# EAGLE schematic schematic (EAGLE 8.6.0)
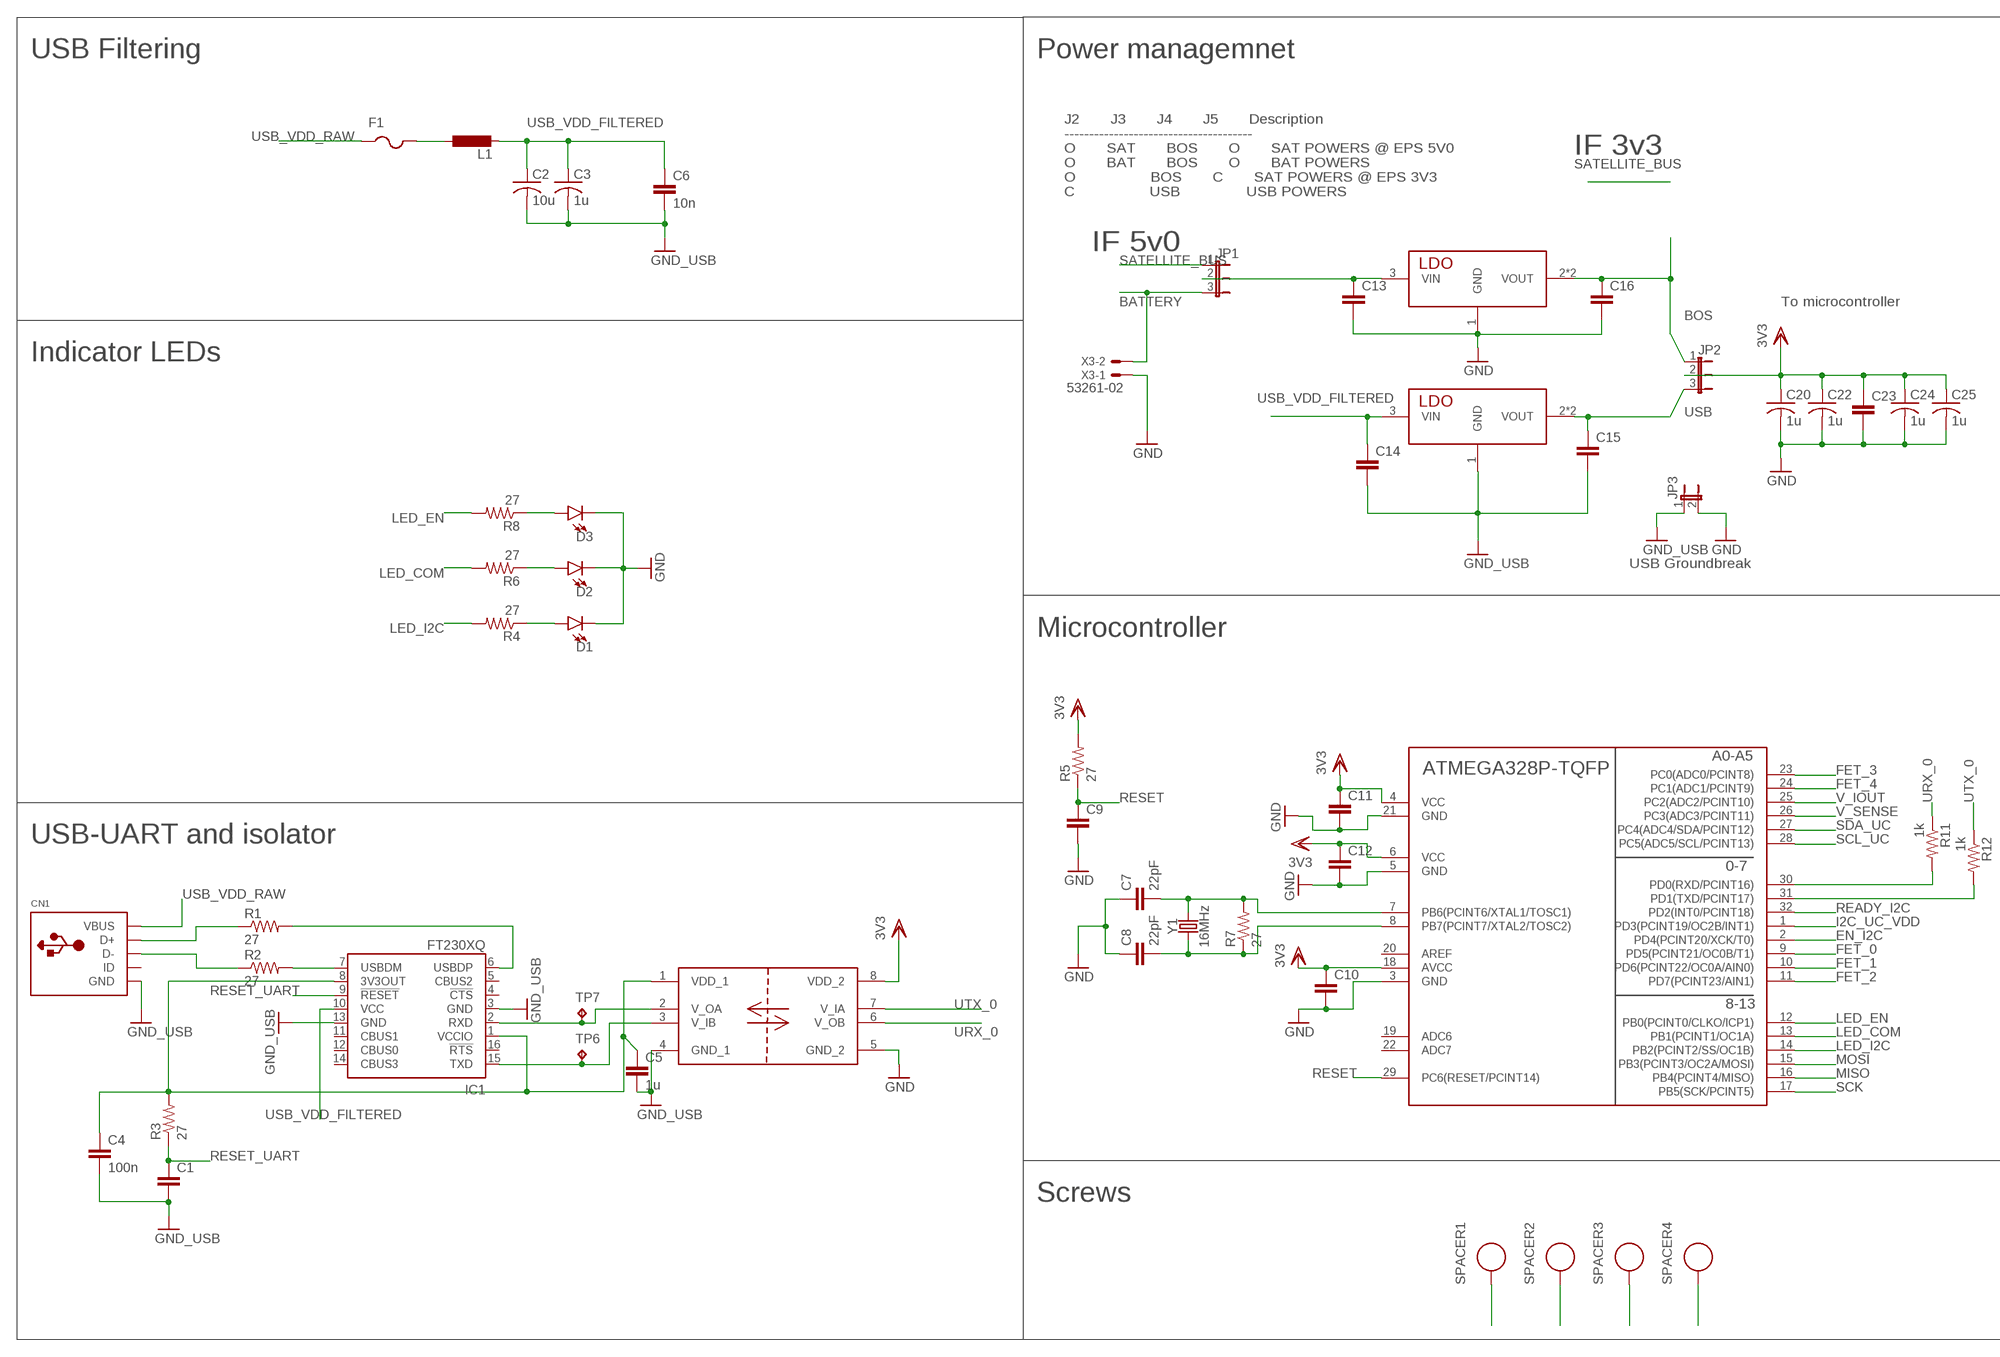
[diagram p0: schematic, sheet 1, part 1 of 2]
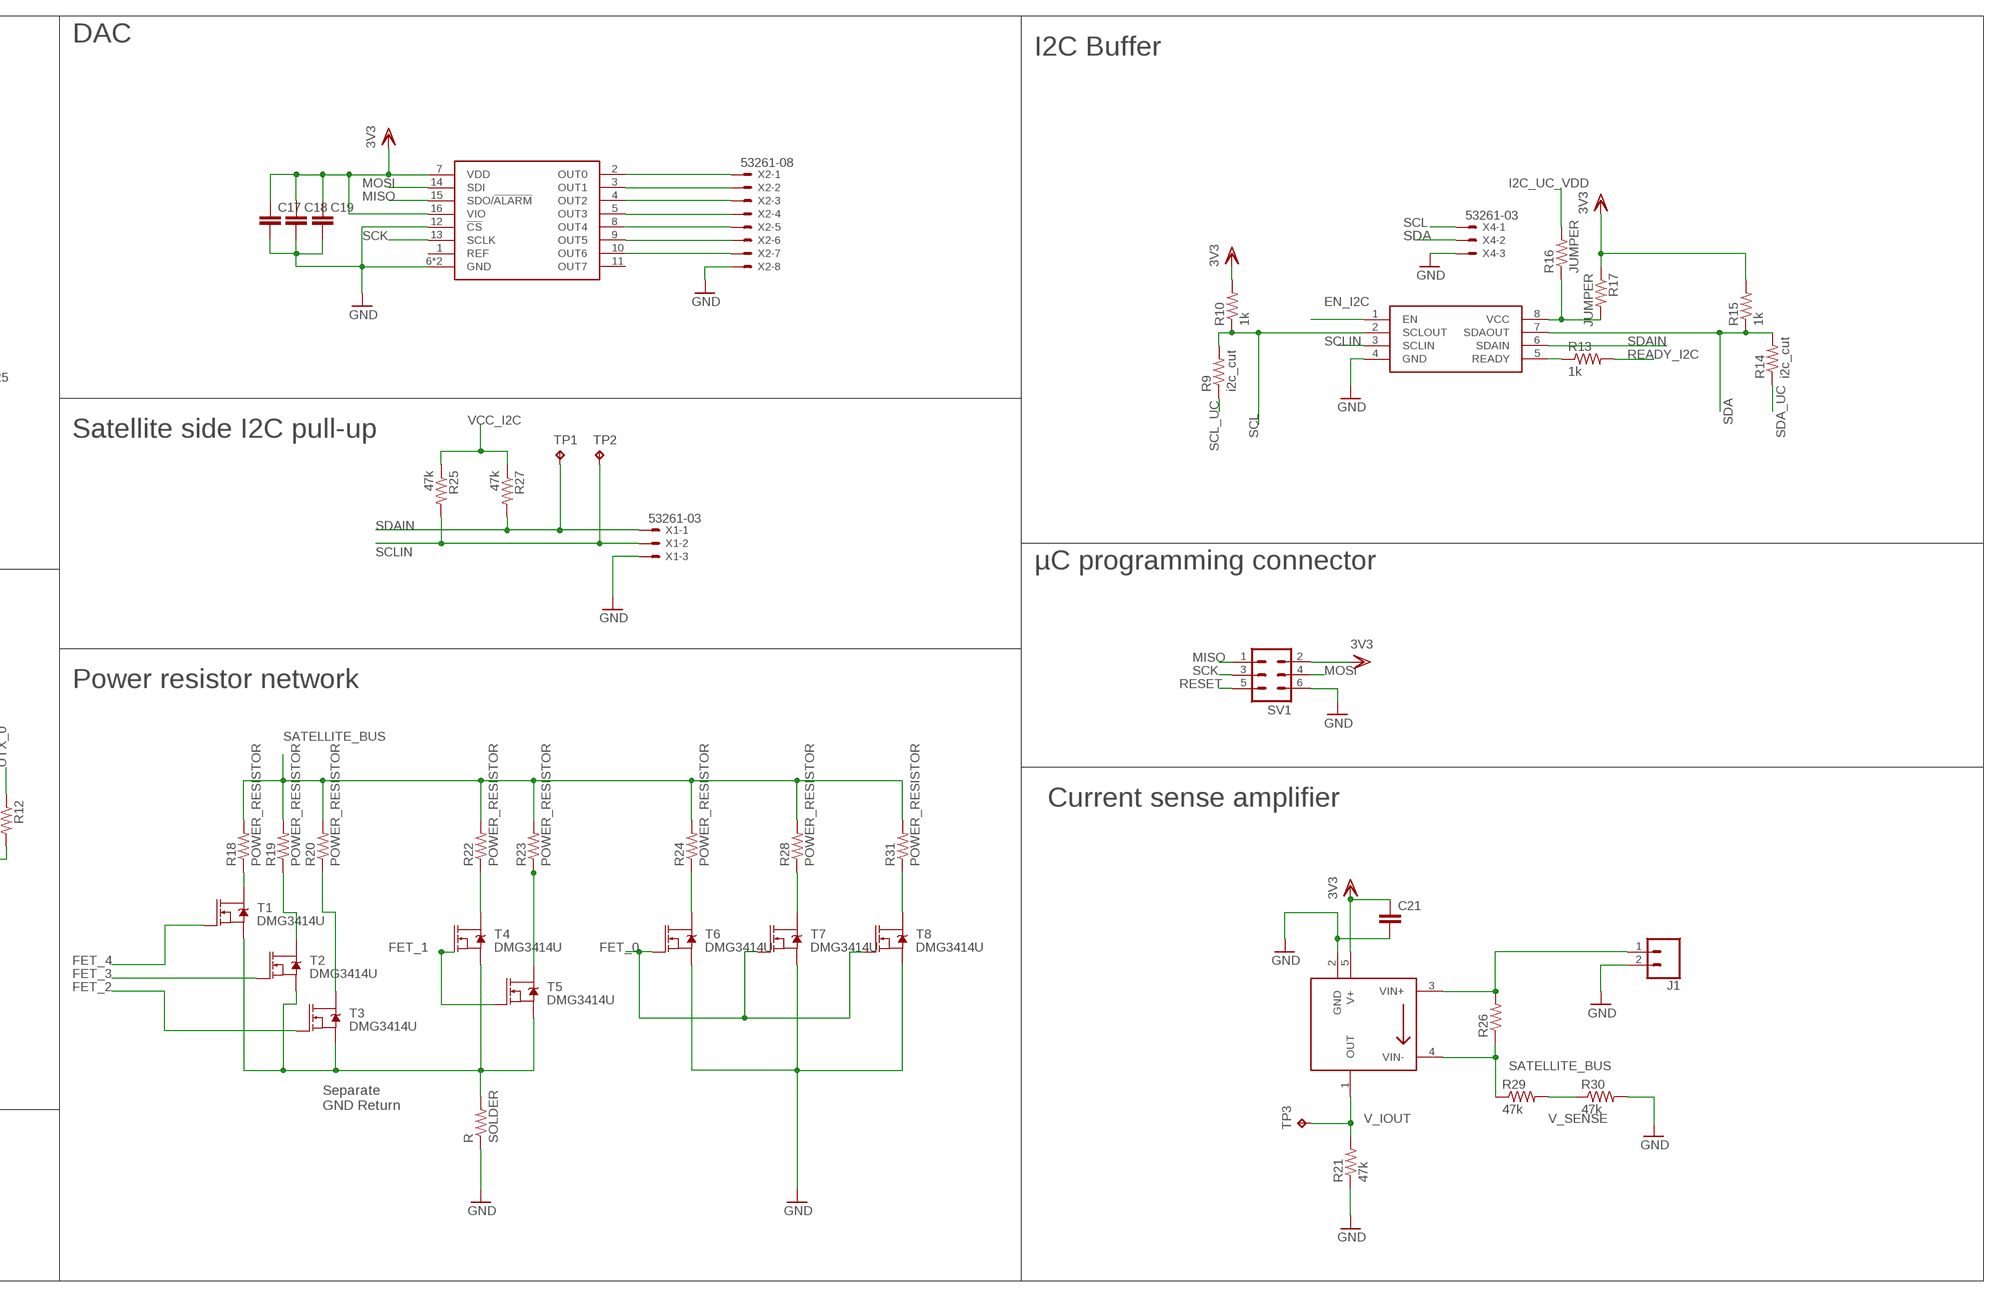
[diagram p1: schematic, sheet 1, part 2 of 2]

## Parts
C1  C-EUC0603  [C0603]
C2  10u  C-USC3225  [C3225]
C3  1u  C-USC3225  [C3225]
C4  100n  C-EUC0603  [C0603]
C5  1u  C-EUC0603  [C0603]
C6  10n  C-EUC0603  [C0603]
C7  22pF  C-EUC0603  [C0603]
C8  22pF  C-EUC0603  [C0603]
C9  C-EUC0603  [C0603]
C10  C-EUC0603  [C0603]
C11  C-EUC0603  [C0603]
C12  C-EUC0603  [C0603]
C13  C-EUC0603  [C0603]
C14  C-EUC0603  [C0603]
C15  C-EUC0603  [C0603]
C16  C-EUC0603  [C0603]
C17  C-EUC0603  [C0603]
C18  C-EUC0603  [C0603]
C19  C-EUC0603  [C0603]
C20  1u  C-USC3225  [C3225]
C21  C-EUC0603  [C0603]
C22  1u  C-USC3225  [C3225]
C23  C-EUC0603  [C0603]
C24  1u  C-USC3225  [C3225]
C25  1u  C-USC3225  [C3225]
CN1  USBMINIB  [USB-MINIB]
D1  LED0603  [LED-0603]
D2  LED0603  [LED-0603]
D3  LED0603  [LED-0603]
F1  PTCFUSE-1812  [1812]
I1  ADUM1201ARZ  [SO08]
I2  LDL1117S33R  [SOT223]
I3  LDL1117S33R  [SOT223]
I4  ATMEGA328PCORRECT  [TQFP32-08]
I5  DAC70508MRTET  [QFN16-3X3MM]
I6  INA139  [DBV_R-PDSO-G5]
IC1  FT230XQ  [QFN16]
J1  CONN_023.5MM  [SCREWTERMINAL-3.5MM-2]
JP1  JP2E  [JP2]
JP2  JP2E  [JP2]
JP3  JP1E  [JP1]
L1  L-EUWE-TPC  [POWER-CHOKE_WE-TPC]
R  SOLDER  R-US_R0805  [R0805]
R1  27  R-US_R0603  [R0603]
R2  27  R-US_R0603  [R0603]
R3  27  R-US_R0603  [R0603]
R4  27  R-US_R0603  [R0603]
R5  27  R-US_R0603  [R0603]
R6  27  R-US_R0603  [R0603]
R7  27  R-US_R0603  [R0603]
R8  27  R-US_R0603  [R0603]
R9  i2c_cut  R-US_R0603  [R0603]
R10  1k  R-US_R0603  [R0603]
R11  1k  R-US_R0603  [R0603]
R12  1k  R-US_R0603  [R0603]
R13  1k  R-US_R0603  [R0603]
R14  i2c_cut  R-US_R0603  [R0603]
R15  1k  R-US_R0603  [R0603]
R16  JUMPER  R-US_R0603  [R0603]
R17  JUMPER  R-US_R0603  [R0603]
R18  POWER_RESISTOR  [POWER_RESISTOR]
R19  POWER_RESISTOR  [POWER_RESISTOR]
R20  POWER_RESISTOR  [POWER_RESISTOR]
R21  47k  R-US_R0603  [R0603]
R22  POWER_RESISTOR  [POWER_RESISTOR]
R23  POWER_RESISTOR  [POWER_RESISTOR]
R24  POWER_RESISTOR  [POWER_RESISTOR]
R25  47k  R-US_R0603  [R0603]
R26  R-US_R0805  [R0805]
R27  47k  R-US_R0603  [R0603]
R28  POWER_RESISTOR  [POWER_RESISTOR]
R29  47k  R-US_R0603  [R0603]
R30  47k  R-US_R0603  [R0603]
R31  POWER_RESISTOR  [POWER_RESISTOR]
SPACER1  WA-SMSR_9775960  [WA-SMSR_9775******]
SPACER2  WA-SMSR_9775960  [WA-SMSR_9775******]
SPACER3  WA-SMSR_9775960  [WA-SMSR_9775******]
SPACER4  WA-SMSR_9775960  [WA-SMSR_9775******]
SV1  MA03-2  [MA03-2]
T1  DMG3414U  [SOT23-EBC]
T2  DMG3414U  [SOT23-EBC]
T3  DMG3414U  [SOT23-EBC]
T4  DMG3414U  [SOT23-EBC]
T5  DMG3414U  [SOT23-EBC]
T6  DMG3414U  [SOT23-EBC]
T7  DMG3414U  [SOT23-EBC]
T8  DMG3414U  [SOT23-EBC]
TP1  TPTP10R  [TP10R]
TP2  TPTP10R  [TP10R]
TP3  TPTP10R  [TP10R]
TP6  TPTP10R  [TP10R]
TP7  TPTP10R  [TP10R]
U1  TCA4311A  [SSOP08]
X1  53261-03  [53261-03]
X2  53261-08  [53261-08]
X3  53261-02  [53261-02]
X4  53261-03  [53261-03]
Y1  16MHz  CRYSTAL-16MHZSMD-5X3.2  [CRYSTAL-SMD-5X3.2-4PAD]

## Nets
BATTERY: JP1.3 X3.2
BOS: C16.1 I2.2(VOUT) I2.2*2(VOUT) JP2.1
CRYSTAL_0: C7.2 I4.7(PB6(PCINT6/XTAL1/TOSC1)) R7.2 Y1.3
CRYSTAL_1: C8.2 I4.8(PB7(PCINT7/XTAL2/TOSC2)) R7.1 Y1.1
DRAIN: R20.P$1 T3.D
EN_I2C: I4.2(PD4(PCINT20/XCK/T0)) U1.1(EN)
FET_0: I4.9(PD5(PCINT21/OC0B/T1)) T6.G T7.G T8.G
FET_1: I4.10(PD6(PCINT22/OC0A/AIN0)) T4.G T5.G
FET_2: I4.11(PD7(PCINT23/AIN1)) T3.G
FET_3: I4.23(PC0(ADC0/PCINT8)) T2.G
FET_4: I4.24(PC1(ADC1/PCINT9)) T1.G
GND: C7.1 C8.1 C9.2 C10.2 C11.2 C12.2 C13.2 C16.2 C17.2 C18.2 C19.2 C20.2 C21.2 C22.2 C23.2 C24.2 C25.2 D1.C D2.C D3.C I1.5(GND_2) I2.1(GND) I4.3(GND) I4.5(GND) I4.21(GND) I5.6(GND) I5.12(!CS) I5.EXT(GND) I6.2(GND) J1.2 JP3.2 R21.1 R30.2 R.1 SV1.6 T6.S T7.S T8.S U1.4(GND) X1.3 X2.8 X3.1 X4.3
GND_USB: C1.2 C2.2 C3.2 C4.2 C5.2 C6.2 C14.2 C15.2 CN1.GND I1.4(GND_1) I3.1(GND) IC1.3(GND) IC1.13(GND) JP3.1
I2C_UC_VDD: I4.1(PD3(PCINT19/OC2B/INT1)) R16.2
JI: SPACER4.1
LED_COM: I4.13(PB1(PCINT1/OC1A)) R6.2
LED_EN: I4.12(PB0(PCINT0/CLKO/ICP1)) R8.2
LED_I2C: I4.14(PB2(PCINT2/SS/OC1B)) R4.2
MISO: I4.16(PB4(PCINT4/MISO)) I5.15(SDO/!ALARM) SV1.1
MOSI: I4.15(PB3(PCINT3/OC2A/MOSI)) I5.14(SDI) SV1.4
N$1: CN1.D- R2.1
N$2: CN1.D+ R1.1
N$3: IC1.7(USBDM) R2.2
N$4: F1.2 L1.1
N$5: C4.1 C5.1 I1.1(VDD_1) IC1.1(VCCIO) IC1.8(3V3OUT) R3.2
N$6: IC1.6(USBDP) R1.2
N$8: D1.A R4.1
N$9: D2.A R6.1
N$10: D3.A R8.1
N$14: R23.P$1 T5.D
N$16: I6.3(VIN+) J1.1 R26.2
N$17: R22.P$1 T4.D
N$18: R.2 T1.S T2.S T3.S T4.S T5.S
N$19: R31.P$1 T8.D
N$20: R28.P$1 T7.D
N$23: R24.P$1 T6.D
N$24: I5.10(OUT6) X2.7
N$26: I5.9(OUT5) X2.6
N$27: I5.8(OUT4) X2.5
N$28: I5.5(OUT3) X2.4
N$31: SPACER2.1
N$32: SPACER1.1
N$33: SPACER3.1
N$35: R18.P$1 T1.D
N$36: R19.P$1 T2.D
N$37: I5.4(OUT2) X2.3
N$38: I5.3(OUT1) X2.2
N$39: I5.2(OUT0) X2.1
READY: R13.1 U1.5(READY)
READY_I2C: I4.32(PD2(INT0/PCINT18)) R13.2
REG_IN: C13.1 I2.3(VIN) JP1.2
RESET: C9.1 I4.29(PC6(RESET/PCINT14)) R5.1 SV1.5
RESET_UART: C1.1 IC1.9(!RESET) R3.1
RX: I4.30(PD0(RXD/PCINT16)) R11.2
SATELLITE_BUS: I6.4(VIN-) JP1.1 R18.P$3 R19.P$3 R20.P$3 R22.P$3 R23.P$3 R24.P$3 R26.1 R28.P$3 R29.1 R31.P$3
SCK: I4.17(PB5(SCK/PCINT5)) I5.13(SCLK) SV1.3
SCL: R9.2 R10.1 U1.2(SCLOUT) X4.1
SCL_UC: I4.28(PC5(ADC5/SCL/PCINT13)) R9.1
SCLIN: R25.2 TP2.TP U1.3(SCLIN) X1.2
SDA: R14.2 R15.1 U1.7(SDAOUT) X4.2
SDA_UC: I4.27(PC4(ADC4/SDA/PCINT12)) R14.1
SDAIN: R27.2 TP1.TP U1.6(SDAIN) X1.1
TX: I4.31(PD1(TXD/PCINT17)) R12.2
TX_USB_SIDE: I1.3(V_IB) IC1.15(TXD) TP6.TP
URX_0: I1.6(V_OB) R11.1
URX_USB_SIDE: I1.2(V_OA) IC1.2(RXD) TP7.TP
USB: C15.1 I3.2(VOUT) I3.2*2(VOUT) JP2.3
USB_VDD_FILTERED: C2.1 C3.1 C6.1 C14.1 I3.3(VIN) IC1.10(VCC) L1.2
USB_VDD_RAW: CN1.VBUS F1.1
UTX_0: I1.7(V_IA) R12.1
V_IOUT: I4.25(PC2(ADC2/PCINT10)) I6.1(OUT) R21.2 TP3.TP
V_SENSE: I4.26(PC3(ADC3/PCINT11)) R29.2 R30.1
VCC_I2C: R16.1 R17.2 R25.1 R27.1 U1.8(VCC)
VDD_3V3: C10.1 C11.1 C12.1 C17.1 C18.1 C19.1 C20.1 C21.1 C22.1 C23.1 C24.1 C25.1 I1.8(VDD_2) I4.4(VCC) I4.6(VCC) I4.18(AVCC) I5.7(VDD) I5.16(VIO) I6.5(V+) JP2.2 R5.2 R10.2 R15.2 R17.1 SV1.2 ; supply symbol labelled 3V3
Unconnected: CN1.ID I4.19(ADC6) I4.20(AREF) I4.22(ADC7) I5.1(REF) I5.11(OUT7) IC1.4(!CTS) IC1.5(CBUS2) IC1.11(CBUS1) IC1.12(CBUS0) IC1.14(CBUS3) IC1.16(!RTS)

## Notes on the sheet
- DAC
- USB Filtering | Power managemnet | I2C Buffer
- IF 3v3
- J2       J3       J4       J5       Description
  --------------------------------------
  O       SAT       BOS       O       SAT POWERS @ EPS 5V0              
  O       BAT       BOS       O       BAT POWERS       
  O                 BOS       C       SAT POWERS @ EPS 3V3
  C                 USB               USB POWERS
- IF 5v0
- To microcontroller
- Indicator LEDs
- Satellite side I2C pull-up
- USB Groundbreak
- µC programming connector
- Microcontroller
- Power resistor network
- USB-UART and isolator | Current sense amplifier
- Separate 
  GND Return
- Screws

## Library data of the parts
C1 C4-C19 C21 C23 = rcl:C-EU: CAPACITOR, European symbol; SPICEPREFIX: C
C2 C3 C20 C22 C24 C25 = rcl:C-US: CAPACITOR, American symbol; SPICEPREFIX: C
CN1 = adafruit:USB: USB Connectors USBMINIB - Surface Mount Female Mini-B USB Connector 4UConnector: 06564 By microbuilder.eu Thru-hole RA Female Mini-B USB Connector 4UConnector: 18732 By ladyada.net
D1-D3 = SparkFun-LED:LED: LED (Generic) Standard schematic elements and footprints for 5mm, 3mm, 1206, and 0603 sized LEDs. Generic LEDs with no color specified.
F1 = adafruit:PTCFUSE: PTC fuses, resettable thermistors
I1 = MIST_libraries:ADUM1201ARZ
I2 I3 = MIST_libraries:LDL1117S33R
I4 = MIST_libraries:ATMEGA328P
I5 = MIST_libraries:DAC70508MRTET
I6 = MIST_libraries:INA139
IC1 = ftdichip:FT230X: USB to BASIC UART IC Auto generated by make-symbol-device-package-bsdl.ulp Rev. 43 Source: Data sheet <http://www.ftdichip.com/Support/Documents/DataSheets/ICs/DS_FT230X.pdf>
J1 = SparkFun-Connectors:CONN_02: Multi connection point. Often used as Generic Header-pin footprint for 0.1 inch spaced/style header connections On any of the 0.1 inch spaced packages, you can populate with these: Break Away Headers - Straight <https://www.sparkfun.com/products/116> (PRT-00116) Break Away Male Headers - Right Angle <https://www.sparkfun.com/products/553> (PRT-00553) Female Headers <https://www.sparkfun.com/products/115> (PRT-00115) Break Away Headers - Machine Pin <https://www.sparkfun.com/products/117> (PRT-00117) Break Away Female Headers - Swiss Machine Pin <https://www.sparkfun.com/products/743> (PRT-00743) For SCREWTERMINALS and SPRING TERMINALS visit here: Screw Terimnals on SparkFun.com <https://www.sparkfun.com/search/results?term=Screw+Terminals> (5mm/3.5mm/2.54mm spacing) This device is also useful as a general connection point to wire up your design to another part of your project. Our various solder wires solder well into these plated through hole pads. Hook-Up Wire - Assortment (Stranded, 22 AWG) <https://www.sparkfun.com/products/11375> (PRT-11375) Hook-Up Wire - Assortment (Solid Core, 22 AWG) <https://www.sparkfun.com/products/11367> (PRT-11367) View the entire wire category on our website here <https://www.sparkfun.com/categories/141> Special notes: Molex polarized connector foot print use with: PRT-08233 with associated crimp pins and housings. 2.54_SCREWTERM for use with PRT-10571. 3.5mm Screw Terminal footprints for PRT-08084 5mm Screw Terminal footprints for use with PRT-08432; PROD_ID: CONN-08399
JP1 JP2 = jumper:JP2E: JUMPER
JP3 = jumper:JP1E: JUMPER
L1 = resistor:L-EU: INDUCTOR, European symbol
R R1-R17 R21 R25-R27 R29 R30 = resistor:R-US_: RESISTOR, American symbol
R18-R20 R22-R24 R28 R31 = MIST_libraries:POWER_RESISTOR
SPACER1-SPACER4 = Wurth_Elektronik_Electromechanic_Assembly_Spacer_rev17a:WA-SMSR_9775***960: WA-SMSR SMD Steel Spacer Ø3.2 Internal non stop Applications Generate distance on the bottom of the PCB, by assembling and soldering on the top Simple and fast automated assembly For distances from 1 to 10 mm (when using standard pcb-thickness of 1.6 mm) With through-hole of 3.2 mm High mechanical forces Characteristics ARTICLE PROPERTIES: Pin length :2.6 mm;​ 3.1 mm;​ 3.6 mm;​ 4.1 mm;​ 4.6 mm;​ 5.1 mm;​ 5.6 mm;​ 6.6 mm;​ 7.6 mm;​ 8.6 mm;​ 9.6 mm;​ 10.6 mm;​ 11.6 mm PROPERTIES Inner Diameter 4.2 mm Outer Diameter 6 mm Hole Diameter 3.2 mm Material Steel Surface Tin Solder Cream Thickness 150 µm PACKAGING PROPERTIES: Packaging Bulk;​ Tape and Reel Packaging Unit (Qty.) 950 mm;​ 700 mm;​ 600 mm;​ 450 mm;​ 350 mm;​ 300 mm <http://katalog.we-online.de/media/images/v2/Family_WA-SMSR_9775xxxx60_no_thread.jpg> Details see: http://katalog.we-online.de/en/em/SMSR_SMD_STEEL_SPACER_%C3%983_2_INTERNAL_NON_STOP Created on 2016 2016 (C) Wurth Elektronik
SV1 = con-lstb:MA03-2: PIN HEADER; OC_FARNELL: unknown; OC_NEWARK: unknown
T1-T8 = MIST_libraries:DMG3414U
TP1-TP3 TP6 TP7 = testpad:TP: Test pad
U1 = MIST_libraries:TCA4311A
X1 X4 = con-molex:53?-03: CONNECTOR wire to board 1.25 mm (.049 inch) pitch header; MF: MOLEX; MPN: 53261-0390; OC_FARNELL: 1125359; OC_NEWARK: 57H5006
X2 = con-molex:53?-08: CONNECTOR wire to board 1.25 mm (.049 inch) pitch header; MF: MOLEX; OC_FARNELL: 1125376; OC_NEWARK: unknown
X3 = con-molex:53?-02: CONNECTOR wire to board 1.25 mm (.049 inch) pitch header; MF: MOLEX; OC_FARNELL: 1125373; OC_NEWARK: unknown
Y1 = SparkFun-Clocks:CRYSTAL-16MHZ: 16MHz Crystal Digikey Example <http://www.digikey.com/product-search/en?keywords=535-9122-1-ND> Frequency: 16MHz Frequency Stability: ±50ppm Frequency Tolerance: ±20ppm Load Capacitance: 18pF SparkFun Products: Pro Micro -5V/16MHz <https://www.sparkfun.com/products/12640> SparkFun Serial Enabled LCD Kit <https://www.sparkfun.com/products/10097>; PROD_ID: XTAL-08218; SF_ID: COM-00094